# EAGLE design Project (EAGLE 6.5.0)
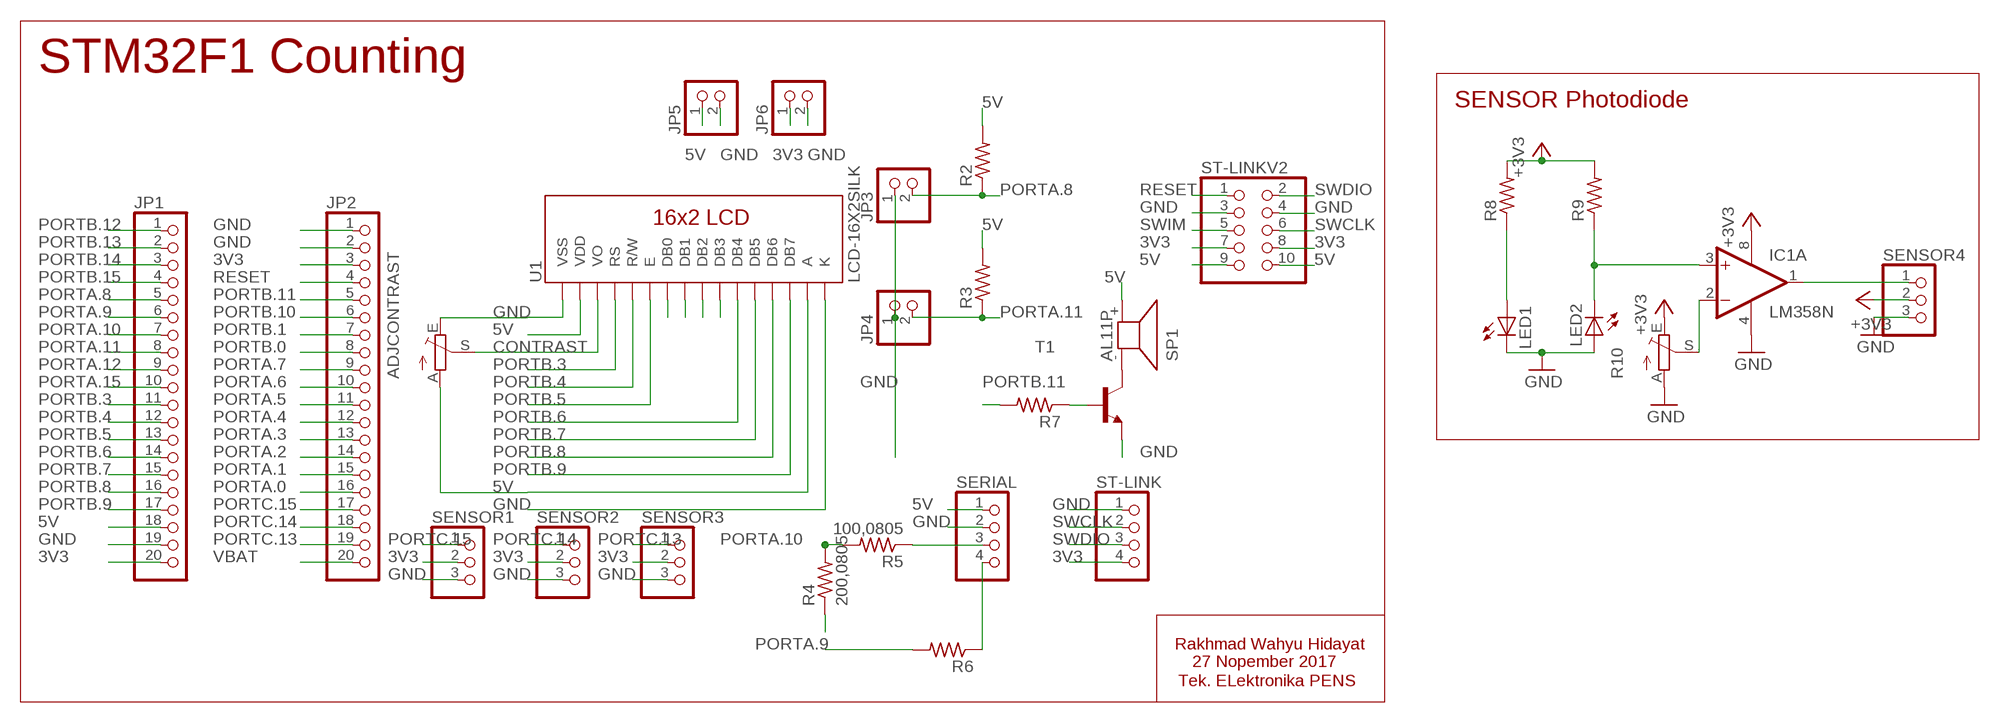
[diagram p0: schematic, sheet 1]

## Parts
ADJCONTRAST  TRIM_EU-CA6V  [CA6V]
IC1  LM358N  [DIL08]
JP1  PINHD-1X20  [1X20]
JP2  PINHD-1X20  [1X20]
JP3  PINHD-1X2  [1X02]
JP4  PINHD-1X2  [1X02]
JP5  PINHD-1X2  [1X02]
JP6  PINHD-1X2  [1X02]
LED1  LED3MM  [LED3MM]
LED2  LED3MM  [LED3MM]
R2  R-US_M0805  [M0805]
R3  R-US_M0805  [M0805]
R4  200,0805  R-US_M0805  [M0805]
R5  100,0805  R-US_M0805  [M0805]
R6  R-US_M0805  [M0805]
R7  R-US_M0805  [M0805]
R8  R-US_0204/7  [0204/7]
R9  R-US_0204/7  [0204/7]
R10  TRIM_EU-CA6V  [CA6V]
SENSOR1  PINHD-1X3  [1X03]
SENSOR2  PINHD-1X3  [1X03]
SENSOR3  PINHD-1X3  [1X03]
SENSOR4  PINHD-1X3  [1X03]
SERIAL  PINHD-1X4  [1X04]
SP1  AL11P  [AL11P]
ST-LINK  PINHD-1X4  [1X04]
ST-LINKV2  PINHD-2X5  [2X05]
T1  -NPN-SOT23-EBC  [SOT23-EBC]
U1  LCD-16X2SILK  [LCD-16X2]

## Nets
3V3: JP1.20 JP2.3 JP6.1 SENSOR1.2 SENSOR2.2 SENSOR3.2 ST-LINK.4 ST-LINKV2.7 ST-LINKV2.8
5V: ADJCONTRAST.A JP1.18 JP5.1 R2.2 R3.2 SERIAL.1 SP1.+ ST-LINKV2.9 ST-LINKV2.10 U1.2(VDD) U1.15(A)
+3V3: IC1.8(P:V+) R8.2 R9.2 R10.E SENSOR4.2
CONTRAST: ADJCONTRAST.S U1.3(VO)
GND: ADJCONTRAST.E IC1.4(P:V-) JP1.19 JP2.1 JP2.2 JP3.1 JP4.1 JP5.2 JP6.2 LED1.K(C) LED2.A R4.1 R10.A SENSOR1.3 SENSOR2.3 SENSOR3.3 SENSOR4.3 SERIAL.2 ST-LINK.1 ST-LINKV2.3 ST-LINKV2.4 T1.E U1.1(VSS) U1.16(K)
N$1: SP1.- T1.C
N$2: R7.1 T1.B
N$3: LED1.A R8.1
N$4: IC1.3(A:+IN) LED2.K(C) R9.1
N$7: U1.7(DB0)
N$8: U1.8(DB1)
N$9: U1.9(DB2)
N$10: U1.10(DB3)
N$11: IC1.2(A:-IN) R10.S
N$12: IC1.1(A:OUT) SENSOR4.1
N$17: R5.1 SERIAL.3
N$18: R6.1 SERIAL.4
PORTA.0: JP2.16
PORTA.1: JP2.15
PORTA.2: JP2.14
PORTA.3: JP2.13
PORTA.4: JP2.12
PORTA.5: JP2.11
PORTA.6: JP2.10
PORTA.7: JP2.9
PORTA.8: JP1.5 JP3.2 R2.1
PORTA.9: JP1.6 R6.2
PORTA.10: JP1.7 R4.2 R5.2
PORTA.11: JP1.8 JP4.2 R3.1
PORTA.12: JP1.9
PORTA.15: JP1.10
PORTB.0: JP2.8
PORTB.1: JP2.7
PORTB.3: JP1.11 U1.4(RS)
PORTB.4: JP1.12 U1.5(R/W)
PORTB.5: JP1.13 U1.6(E)
PORTB.6: JP1.14 U1.11(DB4)
PORTB.7: JP1.15 U1.12(DB5)
PORTB.8: JP1.16 U1.13(DB6)
PORTB.9: JP1.17 U1.14(DB7)
PORTB.10: JP2.6
PORTB.11: JP2.5 R7.2
PORTB.12: JP1.1
PORTB.13: JP1.2
PORTB.14: JP1.3
PORTB.15: JP1.4
PORTC.13: JP2.19 SENSOR3.1
PORTC.14: JP2.18 SENSOR2.1
PORTC.15: JP2.17 SENSOR1.1
RESET: JP2.4 ST-LINKV2.1
SWCLK: ST-LINK.2 ST-LINKV2.6
SWDIO: ST-LINK.3 ST-LINKV2.2
SWIM: ST-LINKV2.5
VBAT: JP2.20
Unconnected: IC1.5(B:+IN) IC1.6(B:-IN) IC1.7(B:OUT)

## Notes on the sheet
- STM32F1 Counting
- SENSOR Photodiode
- Rakhmad Wahyu Hidayat
- 27 Nopember 2017
- Tek. ELektronika PENS

## Library data of the parts
ADJCONTRAST R10 = pot:TRIM_EU-: POTENTIOMETER
IC1 = linear:LM358: OP AMP also LM158; LM258; LM2904 Source: http://cache.national.com/ds/LM/LM158.pdf
JP1 JP2 = pinhead:PINHD-1X20: PIN HEADER
JP3-JP6 = pinhead:PINHD-1X2: PIN HEADER
LED1 LED2 = led:LED: LED OSRAM: - CHIPLED LG R971, LG N971, LY N971, LG Q971, LY Q971, LO R971, LY R971 LH N974, LH R974 LS Q976, LO Q976, LY Q976 LO Q996 - Hyper CHIPLED LW Q18S LB Q993, LB Q99A, LB R99A - SideLED LS A670, LO A670, LY A670, LG A670, LP A670 LB A673, LV A673, LT A673, LW A673 LH A674 LY A675 LS A676, LA A676, LO A676, LY A676, LW A676 LS A679, LY A679, LG A679 - Hyper Micro SIDELED® LS Y876, LA Y876, LO Y876, LY Y876 LT Y87S - SmartLED LW L88C, LW L88S LB L89C, LB L89S, LG L890 LS L89K, LO L89K, LY L89K LS L896, LA L896, LO L896, LY L896 - TOPLED LS T670, LO T670, LY T670, LG T670, LP T670 LSG T670, LSP T670, LSY T670, LOP T670, LYG T670 LG T671, LOG T671, LSG T671 LB T673, LV T673, LT T673, LW T673 LH T674 LS T676, LA T676, LO T676, LY T676, LB T676, LH T676, LSB T676, LW T676 LB T67C, LV T67C, LT T67C, LS T67K, LO T67K, LY T67K, LW E67C LS E67B, LA E67B, LO E67B, LY E67B, LB E67C, LV E67C, LT E67C LW T67C LS T679, LY T679, LG T679 LS T770, LO T770, LY T770, LG T770, LP T770 LB T773, LV T773, LT T773, LW T773 LH T774 LS E675, LA E675, LY E675, LS T675 LS T776, LA T776, LO T776, LY T776, LB T776 LHGB T686 LT T68C, LB T68C - Hyper Mini TOPLED® LB M676 - Mini TOPLED Santana® LG M470 LS M47K, LO M47K, LY M47K Source: http://www.osram.convergy.de LUXEON: - LUMILED® LXK2-PW12-R00, LXK2-PW12-S00, LXK2-PW14-U00, LXK2-PW14-V00 LXK2-PM12-R00, LXK2-PM12-S00, LXK2-PM14-U00 LXK2-PE12-Q00, LXK2-PE12-R00, LXK2-PE12-S00, LXK2-PE14-T00, LXK2-PE14-U00 LXK2-PB12-K00, LXK2-PB12-L00, LXK2-PB12-M00, LXK2-PB14-N00, LXK2-PB14-P00, LXK2-PB14-Q00 LXK2-PR12-L00, LXK2-PR12-M00, LXK2-PR14-Q00, LXK2-PR14-R00 LXK2-PD12-Q00, LXK2-PD12-R00, LXK2-PD12-S00 LXK2-PH12-R00, LXK2-PH12-S00 LXK2-PL12-P00, LXK2-PL12-Q00, LXK2-PL12-R00 Source: www.luxeon.com KINGBRIGHT: KA-3528ASYC Source: www.kingbright.com
R2-R9 = rcl:R-US_: RESISTOR, American symbol
SENSOR1-SENSOR4 = pinhead:PINHD-1X3: PIN HEADER
SERIAL ST-LINK = pinhead:PINHD-1X4: PIN HEADER
SP1 = buzzer:AL11P: SPEAKER Source: Buerklin; OC_FARNELL: unknown; OC_NEWARK: unknown
ST-LINKV2 = pinhead:PINHD-2X5: PIN HEADER
T1 = transistor:*-NPN-: NPN Transistror BF959 corrected 2008.03.06
U1 = SparkFun:LCD-16X2

## Board
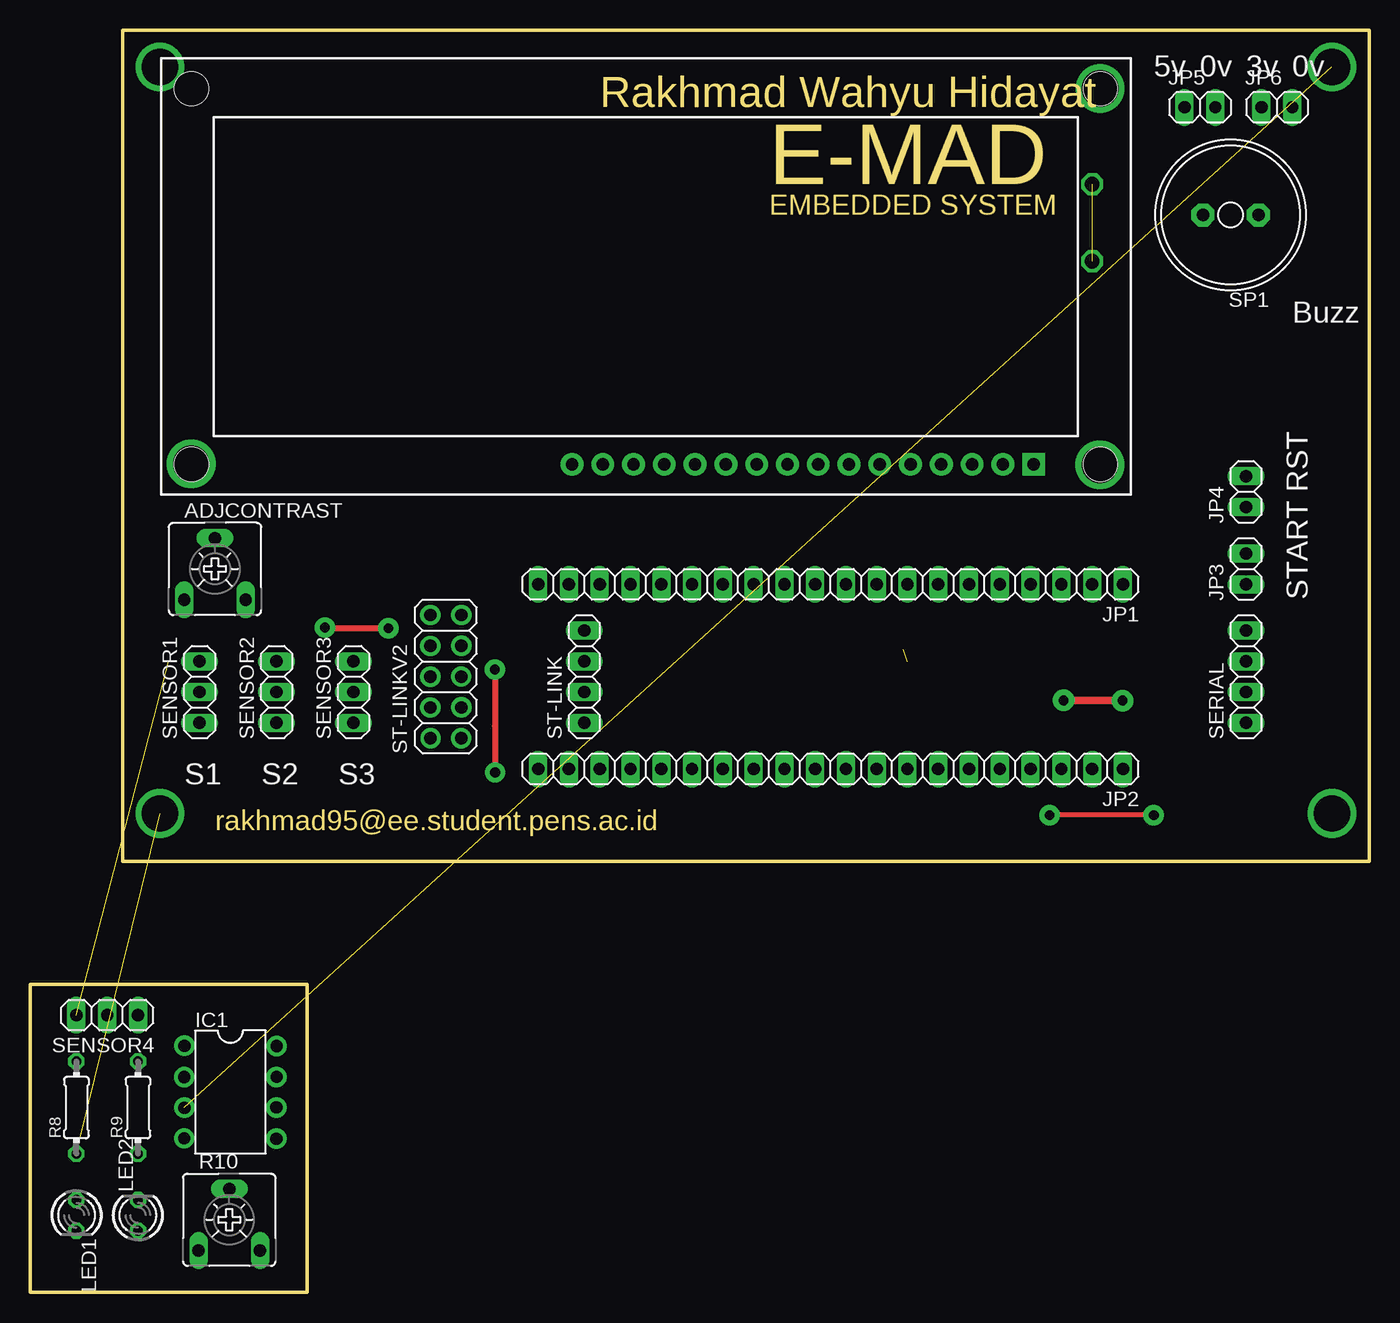
[diagram p1: board, top side]
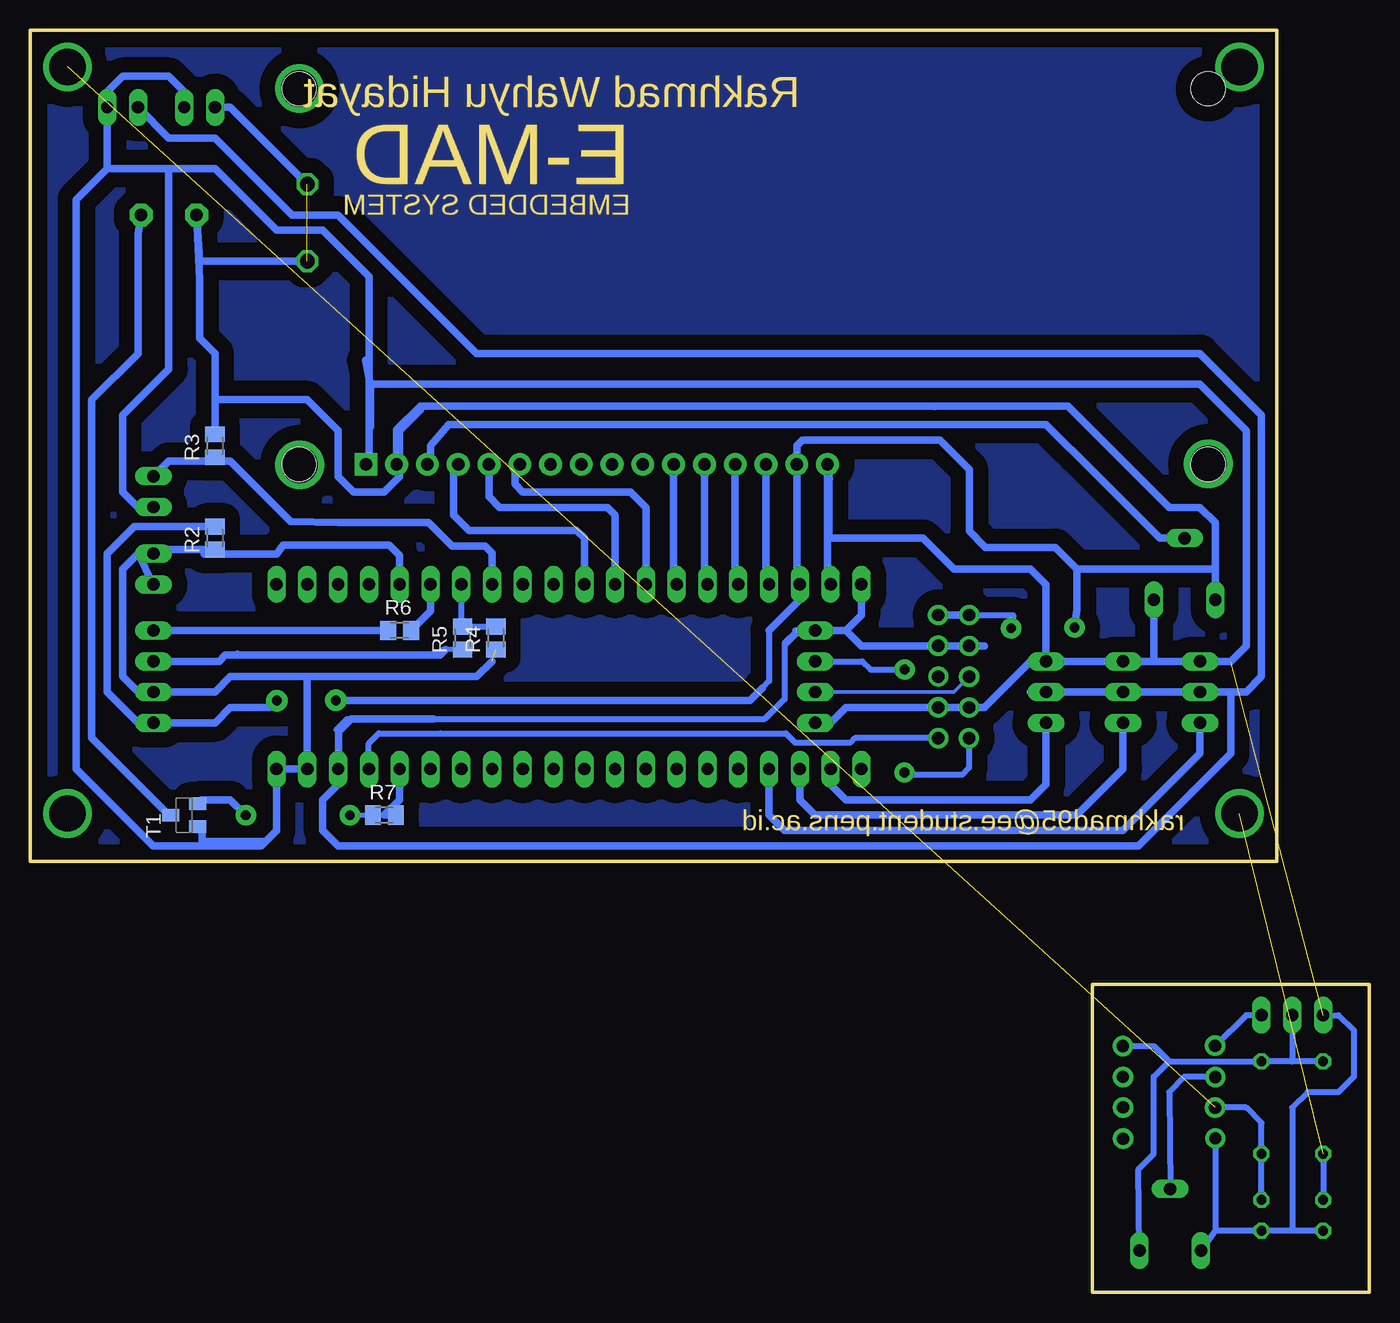
[diagram p2: board, bottom side, seen from below]

Size 110.49 x 104.14 mm. Coordinates in mm from the lower left corner, seen from the top.
Outline: 0,25.4 22.86,25.4 22.86,0 0,0 0,25.4
Outline: 7.62,35.56 110.49,35.56 110.49,104.14 7.62,104.14 7.62,35.56
Copper layers (1*16): Top 0.035mm / dielectric 1.5mm / Bottom 0.035mm
Design rules "default": minimum track width 10mil, minimum drill 24mil, track to track 8mil, track to pad 8mil, pad to pad 8mil, via to via 8mil, smd to smd 8mil, copper to edge 40mil, drill to drill 8mil, minimum pad ring 10mil, minimum via ring 8mil, stop-mask expansion 4mil, vias tented up to drill 0mil, thermal gap 10mil

### Footprints (pad centres in the part's own frame; a part is rotated, then mirrored left to right if it is on the bottom)
CA6V = drill 1.016 long: A -2.54,-2.54; E 2.54,-2.54; S 0,2.54
DIL08 = drill 0.813 pad 1.27: 1 -3.81,-3.81; 2 -1.27,-3.81; 3 1.27,-3.81; 4 3.81,-3.81; 5 3.81,3.81; 6 1.27,3.81; 7 -1.27,3.81; 8 -3.81,3.81
1X20 = drill 1.016 long: 1 -24.13,0; 2 -21.59,0; 3 -19.05,0; 4 -16.51,0; 5 -13.97,0; 6 -11.43,0; 7 -8.89,0; 8 -6.35,0; 9 -3.81,0; 10 -1.27,0; 11 1.27,0; 12 3.81,0; 13 6.35,0; 14 8.89,0; 15 11.43,0; 16 13.97,0; 17 16.51,0; 18 19.05,0; 19 21.59,0; 20 24.13,0
1X02 = drill 1.016 long: 1 -1.27,0; 2 1.27,0
LED3MM = drill 0.813 octagon: A -1.27,0; K 1.27,0
M0805 = smd 1.3 x 1.6: 1 -0.95,0; 2 0.95,0
0204/7 = drill 0.813 octagon: 1 -3.81,0; 2 3.81,0
1X03 = drill 1.016 long: 1 -2.54,0; 2 0,0; 3 2.54,0
1X04 = drill 1.016 long: 1 -3.81,0; 2 -1.27,0; 3 1.27,0; 4 3.81,0
AL11P = drill 1.016 pad 1.905 octagon: + 2.286,0; - -2.286,0
2X05 = drill 1.016 octagon: 1 -5.08,-1.27; 2 -5.08,1.27; 3 -2.54,-1.27; 4 -2.54,1.27; 5 0,-1.27; 6 0,1.27; 7 2.54,-1.27; 8 2.54,1.27; 9 5.08,-1.27; 10 5.08,1.27
SOT23-EBC = smd 1 x 1.4: B 0.95,-1.1; C 0,1.1; E -0.95,-1.1
LCD-16X2 = drill 1.016 pad 1.88 square: 1 -32,15.5 | drill 1.016 pad 1.88: 2 -29.46,15.5; 3 -26.92,15.5; 4 -24.38,15.5; 5 -21.84,15.5; 6 -19.3,15.5; 7 -16.76,15.5; 8 -14.22,15.5; 9 -11.68,15.5; 10 -9.14,15.5; 11 -6.6,15.5; 12 -4.06,15.5; 13 -1.52,15.5; 14 1.02,15.5; 15 3.56,15.5; 16 6.1,15.5 | hole 2.8: -37.5,15.5; -37.5,-15.5; 37.5,15.5; 37.5,-15.5

### Placement (x,y rotation side)
ADJCONTRAST  15.24,59.69 0 top
IC1  16.51,16.51 270 top
JP1  66.04,58.42 180 top
JP2  66.04,43.18 180 top
JP3  100.33,59.69 90 top
JP4  100.33,66.07 90 top
JP5  96.52,97.79 0 top
JP6  102.87,97.79 0 top
LED1  3.81,6.35 270 top
LED2  8.89,6.35 90 top
R2  95.25,62.23 90 bottom
R3  95.25,69.85 90 bottom
R4  72.07,53.99 90 bottom
R5  74.82,53.99 90 bottom
R6  80.01,54.61 0 bottom
R7  81.28,39.37 0 bottom
R8  3.81,15.24 90 top
R9  8.89,15.24 90 top
R10  16.42,5.98 0 top
SENSOR1  13.97,49.53 90 top
SENSOR2  20.32,49.53 90 top
SENSOR3  26.67,49.53 90 top
SENSOR4  6.35,22.86 180 top
SERIAL  100.33,50.8 90 top
SP1  99.06,88.9 180 top
ST-LINK  45.72,50.8 90 top
ST-LINKV2  34.29,50.8 90 top
T1  97.79,39.37 90 bottom
U1  50.8,83.82 180 top

### Tracks (layer width: path | path; a pad name or v marks a point on that pad's centre or on a via)
3V3
  Bottom 0.406: 43.18,54.61 46.99,54.61 48.26,53.34 48.26,48.99 49.95,47.31 84.39,47.31 85.27,46.44
  Bottom 0.51: ST-LINK.4 47.36,54.61 47.36,54.48 48.23,53.61 48.23,48.95 49.87,47.32 77.22,47.32
  Bottom 0.61: ST-LINK.4 43.18,54.61 | JP1.20 41.91,55.88 43.18,54.61 | 77.22,47.32 84.03,47.32 85.05,46.3 85.05,43.22 JP2.3 85.09,41.91 86.36,40.64 86.36,38.1 85.09,36.83 19.05,36.83 11.43,44.45 11.43,49.53 | SENSOR3.2 27.94,49.53 | 31.75,53.34 ST-LINKV2.8 ST-LINKV2.7 41.91,53.34 43.18,54.61 | SENSOR3.2 SENSOR2.2 | SENSOR3.2 SENSOR1.2 11.43,49.53 | 11.43,49.53 10.16,49.53 8.89,50.8 8.89,72.39 13.97,77.47 73.66,77.47 85.09,88.9 88.9,88.9 95.25,95.25 99.06,95.25 JP6.1
5V  (via drill 0.8 pad 1.68, 0.8 pad 1.78, 1 pad 1.68, 1.2 pad 1.02)  (1 unrouted)
  Top 0.51: v29.55,54.79 24.38,54.79 v24.32,54.85
  Top 0.61: v90.13,48.83 v85.27,48.84
  Bottom 0.51: v29.55,54.79 29.38,55.88 ST-LINKV2.10 | v24.32,54.85 23.88,54.85 | 49.53,54.61 49.53,50.42 50.08,49.88
  Bottom 0.61: U1.2 80.26,71.17 78.29,73.14 | 78.29,73.14 33.77,73.14 | ST-LINKV2.10 v33.03,55.88 ST-LINKV2.9 | 49.53,54.61 46.99,57.15 JP1.18 47.24,58.67 U1.15 47.24,69.88 46.79,70.33 35.44,70.33 33.01,67.9 33.01,62.8 31.69,61.48 25.91,61.48 24.13,59.69 | 33.77,73.14 35.87,73.1 | v85.27,48.84 51.12,48.84 50.08,49.88 | v90.13,48.83 90.7,48.26 93.98,48.26 95.25,46.99 SERIAL.1 101.6,46.99 104.14,49.53 104.14,60.96 101.92,63.18 R2.2 | R3.2 95.25,73.66 | 95.25,73.66 95.25,77.47 96.52,78.74 96.52,83.57 SP1.+ 96.52,85.09 v87.63,85.09 | 78.29,73.14 78.29,72.84 80.01,71.12 80.01,67.31 81.28,66.04 83.82,66.04 85.09,67.31 85.09,71.12 87.63,73.66 95.25,73.66 | 24.13,59.69 24.13,56.31 v24.32,54.85 | 33.77,73.14 24.88,73.14 16.51,64.77 13.97,64.77 12.7,63.5 12.7,59.69 | 12.7,59.69 ADJCONTRAST.A 12.7,55.88 | 12.7,59.69 24.13,59.69 | JP5.1 93.98,97.79 v87.63,91.44
+3V3
  Bottom 0.51: R8.2 6.35,19.05 | 6.35,19.05 R9.2 16.51,19.05 | SENSOR4.2 6.35,19.05 | R10.E 19.05,10.16 17.78,11.43 17.78,17.78 16.51,19.05 | IC1.8 17.78,20.32 16.51,19.05
CONTRAST
  Bottom 0.61: U1.3 77.47,68.57 77.47,69.85 75.96,71.61 26.67,71.61 25.16,70.1 24.13,69.07 17.29,62.23 ADJCONTRAST.S
GND  (2 unrouted)
  Bottom 0.51: LED1.K 6.35,5.08 | 6.35,5.08 LED2.A 12.7,5.08 | 12.7,5.08 R10.A | SENSOR4.3 2.54,22.86 1.27,21.59 1.27,17.78 2.54,16.51 5.08,16.51 6.35,15.24 6.35,5.08 | IC1.4 12.7,5.08
  Bottom 0.61: 44.7,67.31 U1.16 44.59,68.43 44.59,62.37 44.45,62.23 36.83,62.23 34.29,59.69 27.94,59.69 26.67,58.42 SENSOR3.3 | 44.7,67.31 44.7,58.67 JP1.19 | 82.8,76.91 82.39,74.78 | 17.78,52.07 SENSOR1.3 11.43,52.07 10.16,53.34 10.16,71.12 13.97,74.93 82.55,74.93 | 17.78,52.07 SENSOR2.3 SENSOR3.3 | 44.55,67.16 44.7,67.31 | ST-LINK.1 44.45,46.99 43.18,48.26 ST-LINKV2.3 ST-LINKV2.4 31.75,48.26 27.94,52.07 SENSOR3.3 | 87.63,50.8 JP2.2 JP2.1 90.17,38.1 | 87.63,50.8 73.66,50.8 72.39,52.07 | 87.63,50.8 93.98,50.8 95.25,49.53 SERIAL.2 101.6,49.53 102.87,50.8 102.87,59.69 101.6,60.96 JP3.1 | ADJCONTRAST.E 17.78,52.07 | 82.42,71.43 82.39,74.78 | U1.1 82.55,68.57 82.55,74.62 | 82.55,74.62 82.39,74.78 | T1.E 96.3,38.37 96.32,37.22 91.06,37.22 90.17,38.1 | 82.55,74.62 82.55,74.93 | 82.55,74.93 82.55,83.82 86.36,87.63 90.17,87.63 95.25,92.71 99.06,92.71 | JP4.1 101.6,64.8 101.6,64.77 102.87,66.04 102.87,72.39 99.06,76.2 99.06,92.71 | 90.17,38.1 91.44,36.83 100.33,36.83 106.68,43.18 106.68,90.17 104.14,92.71 | JP5.2 97.79,99.06 99.06,100.33 102.87,100.33 104.14,99.06 JP6.2 104.14,92.71 | 99.06,92.71 104.14,92.71
N$1
  Bottom 0.61: T1.C 99.06,39.37 105.41,45.72 105.41,73.66 101.6,77.47 101.6,87.38 SP1.-
N$2  (via drill 0.8 pad 1.68)
  Top 0.406: v92.71,39.37 v84.11,39.37
  Bottom 0.406: v84.11,39.37 R7.1
  Bottom 0.61: v92.71,39.37 93.98,40.64 96.37,40.64 T1.B
N$3  (via drill 3 pad 1.68)  (1 unrouted)
  Bottom 0.51: R8.1 LED1.A
  other vias: 10.71,39.51
N$4  (via drill 3 pad 1.68)  (1 unrouted)
  Bottom 0.51: LED2.K R9.1 8.89,13.97 10.16,15.24 IC1.3
  other vias: 107.42,101.12
N$5  (via drill 3 pad 1.68)
  other vias: 107.42,39.51
N$6  (via drill 3 pad 1.68)
  other vias: 10.71,101.12
N$11
  Bottom 0.51: IC1.2 15.24,17.78 16.51,16.51 R10.S
N$12
  Bottom 0.51: SENSOR4.1 10.16,22.86 IC1.1
N$13  (via drill 1 pad 1.68)
  other vias: 35.56,55.88
N$14  (via drill 1 pad 1.68)
  other vias: 33.02,53.34
N$15  (via drill 1 pad 1.68)
  other vias: 35.56,53.35
N$16  (via drill 1 pad 1.68)
  other vias: 33.02,50.8
N$17
  Bottom 0.406: R5.1 76.2,53.05 76.45,53.05 77.02,52.48 93.12,52.48 93.41,52.77
  Bottom 0.61: SERIAL.3 94.92,52.07 94.41,52.58 76.67,52.58 76.2,53.05
N$18
  Bottom 0.61: R6.1 SERIAL.4
N$19  (via drill 1 pad 1.68)
  other vias: 35.55,50.81
N$20  (via drill 1 pad 1.68)
  other vias: 33.03,48.25
N$21  (via drill 1 pad 1.68)
  other vias: 35.56,48.27
N$22  (via drill 1 pad 1.68)
  other vias: 33.03,45.73
N$23  (via drill 1 pad 1.68)
  other vias: 35.55,45.73
N$24  (via drill 1 pad 1.68)
  other vias: 12.72,20.34
N$25  (via drill 1 pad 1.68)
  other vias: 12.71,17.75
N$26  (via drill 1 pad 1.68)
  other vias: 12.71,15.23
N$27  (via drill 1 pad 1.68)
  other vias: 12.71,12.7
N$28  (via drill 1 pad 1.68)
  other vias: 20.31,12.68
N$29  (via drill 1 pad 1.68)
  other vias: 20.31,15.25
N$30  (via drill 1 pad 1.68)
  other vias: 20.32,17.77
N$31  (via drill 1 pad 1.68)
  other vias: 20.33,20.31
N$32  (via drill 3 pad 1.68)
  other vias: 88.28,99.35
N$33  (via drill 3 pad 1.68)
  other vias: 13.28,68.36
N$34  (via drill 3 pad 1.68)
  other vias: 88.26,68.29
N$35
  pour Bottom (isolate 1.27, rank 3): 7.62,104.14 110.49,104.14 110.49,35.56 7.62,35.56
PORTA.8
  Bottom 0.61: JP1.5 80.03,58.44 80.03,60.77 80.9,61.65 89.64,61.65 90.17,60.91 96.15,60.91 R2.1 100.01,61.28 JP3.2
PORTA.9
  Bottom 0.61: JP1.6 77.47,56.2 R6.2
PORTA.10
  Bottom 0.51: JP1.7 74.93,55.05 R5.2 R4.2
PORTA.11
  Bottom 0.61: JP1.8 72.39,61.01 72.94,61.56 75.7,61.56 77.64,63.5 83.7,63.5 | 83.82,63.5 83.7,63.5 | 83.7,63.5 85.08,63.52 89.01,63.61 93.98,68.58 94.93,68.58 R3.1 95.57,68.58 99.06,68.58 JP4.2
PORTB.3
  Bottom 0.61: JP1.11 64.77,62.23 65.41,62.87 74.3,62.87 75.56,64.14 75.56,67.94 U1.4
PORTB.4
  Bottom 0.61: U1.5 72.64,65.66 71.75,64.77 62.87,64.77 62.23,64.14 JP1.12
PORTB.5
  Bottom 0.61: JP1.13 59.69,64.77 60.96,66.04 69.85,66.04 70.48,66.68 70.48,67.94 U1.6
PORTB.6
  Bottom 0.61: U1.11 57.4,58.67 JP1.14
PORTB.7
  Bottom 0.61: U1.12 54.86,58.67 JP1.15
PORTB.8
  Bottom 0.61: U1.13 52.32,58.67 JP1.16
PORTB.9
  Bottom 0.61: U1.14 49.78,58.67 JP1.17
PORTB.11
  Bottom 0.61: R7.2 81.28,39.37 80.01,40.64 JP2.5
PORTC.13
  Bottom 0.61: JP2.19 44.45,41.91 43.18,40.64 27.94,40.64 26.67,41.91 SENSOR3.1
PORTC.14
  Bottom 0.61: JP2.18 46.99,40.64 45.72,39.37 24.13,39.37 20.32,43.18 SENSOR2.1
PORTC.15
  Bottom 0.61: JP2.17 49.53,39.37 48.26,38.1 20.32,38.1 13.97,44.45 SENSOR1.1
RESET
  Bottom 0.51: ST-LINKV2.1 42.42,45.72 42.81,45.33 47.36,45.33 48.01,45.98 48.15,46.12 76.64,46.12 81.73,46.12 82.56,45.28 82.56,43.2 JP2.4
SWCLK
  Bottom 0.305: ST-LINK.2 34.29,49.53 ST-LINKV2.6
SWDIO  (via drill 0.8 pad 1.68)
  Top 0.51: v38.34,51.38 38.34,46.71 v38.36,42.89
  Bottom 0.51: ST-LINK.3 41.86,52.07 41.16,51.37 38.36,51.37 v38.34,51.38 | ST-LINKV2.2 33.02,43.27 33.59,42.7 38.16,42.7 v38.36,42.89

### Text on the board
Dimension: Rakhmad Wahyu Hidayat | E-MAD | EMBEDDED SYSTEM | rakhmad95@ee.student.pens.ac.id
tPlace: 5v | 0v | 3v | 0v | Buzz | RST | START | S1 | S2 | S3
tOrigins: Serial